# Altium project Accumulator_MGMT_Sys.PrjPcb (part 2 of 2)

## Sheet Latch - AMS.SchDoc
size A4
Used 4 times, as channels Latching - AMS/Latch Circuit, Latching - AMS/Latch Circuit, Latching - AMS/Latch Circuit, Latching - AMS/Latch Circuit. Parts and nets are listed once, with the designators drawn on the sheet.
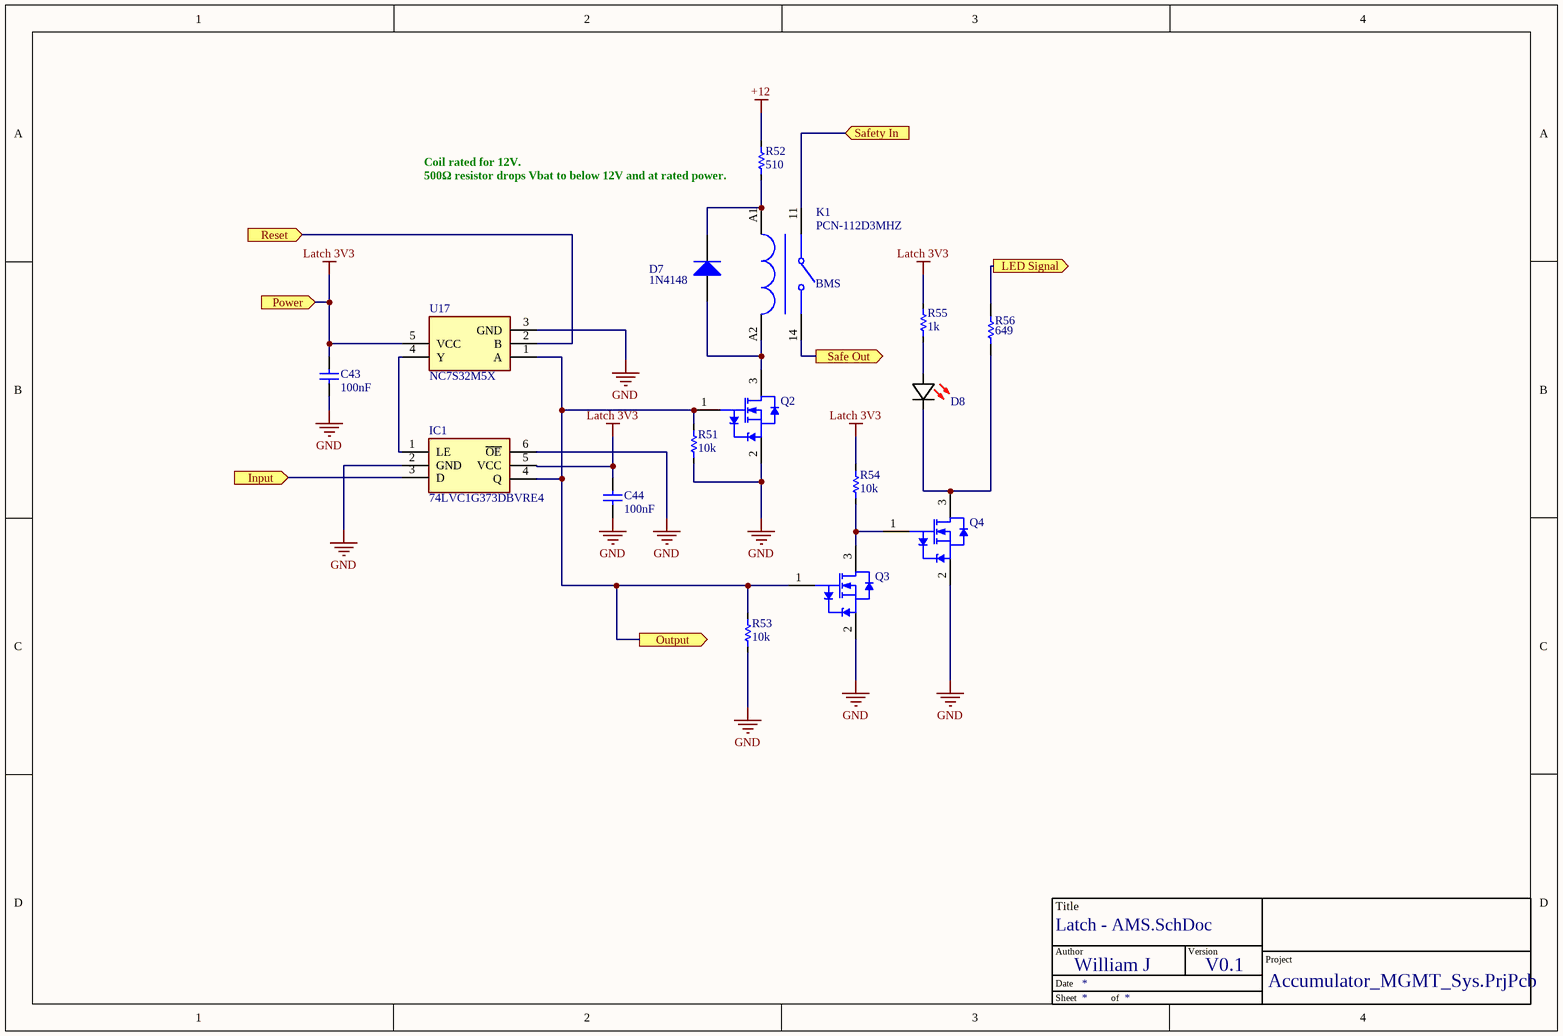
[diagram p7: Latch - AMS.SchDoc]

### Parts
*?  TitleBlock  (value not drawn)  (graphical)
C43  value 100nF  [C_0603]  (hidden comment: C0603C104K3RAC7013)
C44  value 100nF  [C_0603]  (hidden comment: C0603C104K3RAC7013)
D7  1N4148  [425]
D8  150060SS55040  [LED (0603)]  (value not drawn)
IC1  74LVC1G373DBVRE4  [SN74LVC1G373]
K1  PCN-112D3MHZ  [PCN-112D3MHZ]
Q2  BSS138BK,215  [NXP-SOT23_N]  (value not drawn)
Q3  BSS138BK,215  [NXP-SOT23_N]  (value not drawn)
Q4  BSS138BK,215  [NXP-SOT23_N]  (value not drawn)
R51  value 10k  [R-0603]  (hidden comment: RC0603FR-1310KL)
R52  value 510  [R_0805]  (hidden comment: RC0805JR-07510RL)
R53  value 10k  [R-0603]  (hidden comment: RC0603FR-1310KL)
R54  value 10k  [R-0603]  (hidden comment: RC0603FR-1310KL)
R55  value 1k  [R-0603]  (hidden comment: CR0603AFX-1001ELF)
R56  value 649  [RESC6332X06N]  (hidden comment: CRCW2512649RFKEG)
U17  NC7S32M5X  [SOT95P275X110-5N]

### Ports
Input (in), LED Signal (out), Output (out), Power (in), Reset (in), Safe Out (out), Safety In (in)

### Nets
+12: R52.2
GND: C43.1 C44.1 IC1.2(GND) IC1.6(~{OE}) Q2.2(S) Q3.2(S) Q4.2(S) R51.1 R53.1 U17.3(GND)
Latch 3V3: C43.2 C44.2 IC1.5(VCC) R54.2 R55.2 U17.5(VCC) ; port Power
Input: IC1.3(D) ; port Input
LED Signal: R56.2 ; port LED Signal
Output: IC1.4(Q) Q2.1(G) Q3.1(G) R51.2 R53.2 U17.1(A) ; port Output
Reset: U17.2(B) ; port Reset
Safe Out: K1.14 ; port Safe Out
Safety In: K1.11 ; port Safety In
NetD7_1: D7.1(A) K1.A2 Q2.3(D)
NetD7_2: D7.2(K) K1.A1 R52.1
NetD8_1: D8.1(K) Q4.3(D) R56.1
NetD8_2: D8.2(A) R55.1
NetIC1_1: IC1.1(LE) U17.4(Y)
NetQ3_3: Q3.3(D) Q4.1(G) R54.1

### Channels
Latching - AMS/Latch Circuit: designators *?=*?_Latching_-_AMS_Latch_Circuit#1 C43=C43_Latching_-_AMS_Latch_Circuit#1 C44=C44_Latching_-_AMS_Latch_Circuit#1 D7=D7_Latch_Circuit4 D8=D8_Latch_Circuit4 IC1=IC1_Latch_Circuit4 K1=K1_Latch_Circuit4 Q2=Q2_Latch_Circuit4 Q3=Q3_Latch_Circuit4 Q4=Q4_Latch_Circuit4 R51=R51_Latching_-_AMS_Latch_Circuit#1 R52=R52_Latching_-_AMS_Latch_Circuit#1 R53=R53_Latching_-_AMS_Latch_Circuit#1 R54=R54_Latching_-_AMS_Latch_Circuit#1 R55=R55_Latching_-_AMS_Latch_Circuit#1 R56=R56_Latch_Circuit4 U17=U17_Latch_Circuit4; ports Input=NetIC1_Latch_Circuit4_3 LED Signal=IMD.LED Output=MCU.IMD Power=3V3-BMS Reset=Reset Safe Out=NetK1_Latch_Circuit2_11 Safety In=NetK1_Latch_Circuit1_14
Latching - AMS/Latch Circuit: designators *?=*?_Latching_-_AMS_Latch_Circuit#2 C43=C43_Latching_-_AMS_Latch_Circuit#2 C44=C44_Latching_-_AMS_Latch_Circuit#2 D7=D7_Latch_Circuit3 D8=D8_Latch_Circuit3 IC1=IC1_Latch_Circuit3 K1=K1_Latch_Circuit3 Q2=Q2_Latch_Circuit3 Q3=Q3_Latch_Circuit3 Q4=Q4_Latch_Circuit3 R51=R51_Latching_-_AMS_Latch_Circuit#2 R52=R52_Latching_-_AMS_Latch_Circuit#2 R53=R53_Latching_-_AMS_Latch_Circuit#2 R54=R54_Latching_-_AMS_Latch_Circuit#2 R55=R55_Latching_-_AMS_Latch_Circuit#2 R56=R56_Latch_Circuit3 U17=U17_Latch_Circuit3; ports Input=BMS-Ready LED Signal=AMS.LED Output=MCU.AMS Power=3V3-BMS Reset=Reset Safe Out=NetK1_Latch_Circuit1_11 Safety In=Safe-IN
Latching - AMS/Latch Circuit: designators *?=*?_Latching_-_AMS_Latch_Circuit#3 C43=C43_Latching_-_AMS_Latch_Circuit#3 C44=C44_Latching_-_AMS_Latch_Circuit#3 D7=D7_Latch_Circuit2 D8=D8_Latch_Circuit2 IC1=IC1_Latch_Circuit2 K1=K1_Latch_Circuit2 Q2=Q2_Latch_Circuit2 Q3=Q3_Latch_Circuit2 Q4=Q4_Latch_Circuit2 R51=R51_Latching_-_AMS_Latch_Circuit#3 R52=R52_Latching_-_AMS_Latch_Circuit#3 R53=R53_Latching_-_AMS_Latch_Circuit#3 R54=R54_Latching_-_AMS_Latch_Circuit#3 R55=R55_Latching_-_AMS_Latch_Circuit#3 R56=R56_Latch_Circuit2 U17=U17_Latch_Circuit2; ports Input=PDOC-Ready LED Signal=PDOC.LED Output=MCU.PDOC Power=3V3-BMS Reset=Reset Safe Out=Safe-OUT Safety In=NetK1_Latch_Circuit2_11
Latching - AMS/Latch Circuit: designators *?=*?_Latching_-_AMS_Latch_Circuit#4 C43=C43_Latching_-_AMS_Latch_Circuit#4 C44=C44_Latching_-_AMS_Latch_Circuit#4 D7=D7_Latch_Circuit1 D8=D8_Latch_Circuit1 IC1=IC1_Latch_Circuit1 K1=K1_Latch_Circuit1 Q2=Q2_Latch_Circuit1 Q3=Q3_Latch_Circuit1 Q4=Q4_Latch_Circuit1 R51=R51_Latching_-_AMS_Latch_Circuit#4 R52=R52_Latching_-_AMS_Latch_Circuit#4 R53=R53_Latching_-_AMS_Latch_Circuit#4 R54=R54_Latching_-_AMS_Latch_Circuit#4 R55=R55_Latching_-_AMS_Latch_Circuit#4 R56=R56_Latch_Circuit1 U17=U17_Latch_Circuit1; ports Input=BSPD-Ready LED Signal=BSPD.LED Output=MCU.BSPD Power=3V3-BMS Reset=Reset Safe Out=NetK1_Latch_Circuit1_14 Safety In=NetK1_Latch_Circuit1_11

### Notes on the sheet
- (near R52) Coil rated for 12V.
  500Ω resistor drops Vbat to below 12V and at rated power.
- (near K1) BMS
- (in symbol TitleBlock) Title; Author; Version; Project; Date; Sheet; of

### Library data of the parts
C43 C44 = Capacitor: ComponentLink1Description: New link; ComponentLink1URL: *
D7 = 1N4148W-7-F: DIODE GEN PURP 100V 300MA SOD123; Manufacturer 1: Diodes; Forward Current: 150mA; Element Configuration: Single; Reverse Recovery Time: 4ns; Max Forward Surge Current (Ifsm): 2A; Polarity: Standard; Voltage Rating (DC): 75V; Power Rating: 400mW; Capacitance: 2pF; Peak Reverse Current: 1uA; Forward Voltage: 1.25V; Supplier 1: Digi-Key; Supplier Part Number 1: 1N4148W-FDIDKR-ND; Manufacturer Part Number 1: 1N4148W-7-F; Stock 1: 3523690; Pricing 1: 1=0.16000, 10=0.14600, 25=0.13880, 100=0.06110, 250=0.05868, 500=0.04800, 1000=0.03333 (USD); RoHS: Yes; Mount: Surface Mount; Number of Pins: 2; Weight: 0.000353oz; Contact Plating: Tin,Matte; Min Operating Temperature: -65°C; Max Operating Temperature: 150°C; Voltage: 100V; Packaging: Tape and Reel; Max Repetitive Reverse Voltage (Vrrm): 100V; Peak Non-Repetitive Surge Current: 2A; Current Rating: 150mA; Output Current: 150mA; Max Surge Current: 2A; Package Quantity: 3000; Recovery Time: 4ns; Max Reverse Voltage (DC): 100V; Average Rectified Current: 300mA; Power Dissipation: 400mW; Length: 2.85mm; Height: 1.25mm; Width: 1.7mm; Radiation Hardening: No; REACH SVHC: No SVHC; Lead Free: Lead Free; ComponentLink1URL: https://datasheet.ciiva.com/911/ds30086-911734.pdf?src-supplier=Digi-Key; ComponentLink1Description: https://datasheet.ciiva.com/911/ds30086-911734.pdf?src-supplier=Digi-Key; ComponentLink2URL: https://datasheet.ciiva.com/911/ds30086-911735.pdf?src-supplier=Digi-Key; ComponentLink2Description: https://datasheet.ciiva.com/911/ds30086-911735.pdf?src-supplier=Digi-Key; ComponentLink3URL: https://datasheet.ciiva.com/911/ds30086-911736.pdf?src-supplier=Digi-Key; ComponentLink3Description: https://datasheet.ciiva.com/911/ds30086-911736.pdf?src-supplier=Digi-Key; ComponentLink4URL: https://datasheet.ciiva.com/8300/ds30086-8300392.pdf?src-supplier=Avnet; ComponentLink4Description: https://datasheet.ciiva.com/8300/ds30086-8300392.pdf?src-supplier=Avnet; ComponentLink5URL: https://datasheet.ciiva.com/25919/ds30086-25919609.pdf?src-supplier=Avnet+Europe; ComponentLink5Description: https://datasheet.ciiva.com/25919/ds30086-25919609.pdf?src-supplier=Avnet+Europe; ComponentLink6URL: https://datasheet.ciiva.com/22695/1915529-22695239.pdf?src-supplier=Element14; ComponentLink6Description: https://datasheet.ciiva.com/22695/1915529-22695239.pdf?src-supplier=Element14; ComponentLink7URL: https://datasheet.ciiva.com/1179/1915529-1179304.pdf?src-supplier=Element14; ComponentLink7Description: https://datasheet.ciiva.com/1179/1915529-1179304.pdf?src-supplier=Element14; ComponentLink8URL: https://datasheet.ciiva.com/4435/ds30086-4435128.pdf?src-supplier=Mouser; ComponentLink8Description: https://datasheet.ciiva.com/4435/ds30086-4435128.pdf?src-supplier=Mouser; ComponentLink9URL: https://datasheet.ciiva.com/15219/getdatasheetpartid-110030-15219548.pdf?src-supplier=Verical; ComponentLink9Description: https://datasheet.ciiva.com/15219/getdatasheetpartid-110030-15219548.pdf?src-supplier=Verical; ComponentLink10URL: https://datasheet.ciiva.com/8303/ds30086-8303197.pdf?src-supplier=Avnet; ComponentLink10Description: https://datasheet.ciiva.com/8303/ds30086-8303197.pdf?src-supplier=Avnet
D8 = 150060SS55040: LED RED DIFFUSED 0603 SMD; Manufacturer: Wurth Electronics; Lens Style: Flat; Luminous Intensity: 70mcd; Forward Voltage: 2V; Test Current: 20mA; Viewing Angle: 140°; Dominant Wavelength: 630nm; Lens Size: 0.8mm; Supplier 1: Mouser; Manufacturer Part Number: 150060SS55040; RoHS: No; Category: LEDs; Stock 1: 17006; Pricing 1: 1=0.18000, 10=0.16800, 50=0.16800, 100=0.15200, 1000=0.12100, 10000=0.10600 (USD); Mount: Surface Mount; Case/Package: 0603; Color: Red; Case Code (Imperial): 0603; Case Code (Metric): 1608; Packaging: Tape and Reel; Lens Transparency: Diffused; Length: 1.6mm; Width: 0.8mm; Height: 0.5mm; RoHS Compliant: No; Supplier Part Number 1: 710-150060SS55040
IC1 = 74LVC1G373DBVRE4: Integrated Circuit; Manufacturer_Name: Texas Instruments; Datasheet Link: http://www.ti.com/general/docs/suppproductinfo.tsp?distId=10&gotoUrl=http%3A%2F%2Fwww.ti.com%2Flit%2Fgpn%2Fsn74lvc1g373; Height: 1.45mm; Manufacturer_Part_Number: 74LVC1G373DBVRE4
K1 = PCN-112D3MHZ: Relay
Q2-Q4 = CMP-1259-00087-1: N-Channel Trench MOSFET, 60 V, 0.36 A, -55 to 150 degC, 3-Pin SOT23, Tape and Reel; Manufacturer: NXP Semiconductors; Channel Type: N; IDM [max] (A): 1.2; VDS [max] (V): 60; Packing: Tape & Reel; ID [max] (A): 0.36; Automotive Qualified: Y; VGSth [typ] (V): 1.1; PackageReference: SOT23; Code_JEDEC: TO-236AB; PackageDescription: 3-Pin Small Outline Transistor Package, Body 2.9 x 1.3 mm, Pitch 0.95 mm; ComponentLink2URL: http://www.nxp.com/documents/data_sheet/BSS138BK.pdf; PartNumber: BSS138BK,215; DatasheetVersion: Rev. 1; ComponentLink3Description: Package Specification; ComponentLink3URL: http://www.nxp.com/documents/outline_drawing/sot023_po.pdf; Mounting Technology: Surface Mount; ComponentLink1URL: http://www.nxp.com/; ComponentLink1Description: Manufacturer URL; ComponentLink2Description: Datasheet; PackageVersion: 06-03-16, 03/2006
R51-R55 = Resistor
R56 = CRCW2512649RFKEG: RES SMD 649 OHM 1% 1W 2512; Manufacturer 1: Vishay Dale; Temperature Coefficient: 100ppm/°C; Voltage Rating (DC): 500V; Supplier 1: Digi-Key; Supplier Part Number 1: 541-649AFCT-ND; Manufacturer Part Number 1: CRCW2512649RFKEG; Stock 1: 2166; Pricing 1: 1=0.38000, 10=0.31800, 100=0.12420, 1000=0.05198 (USD); RoHS: Yes; Case/Package: 2512; Case Code (Metric): 6432; Case Code (Imperial): 2512; Min Operating Temperature: -55°C; Max Operating Temperature: 155°C; Package Quantity: 10; Tolerance: 1%; Packaging: Tape and Reel; Composition: Thick Film; Number of Terminations: 2; Features: Automotive AEC-Q200; Max Power Dissipation: 1W; Length: 0.248inch; Height: 0.028inch; Width: 0.124inch; Lead Free: Lead Free
U17 = NC7S32M5X: OR GATEEEE; Manufacturer_Name: ON Semiconductor; Datasheet Link: https://componentsearchengine.com/Datasheets/2/NC7S32M5X.pdf; Height: 1.1mm; Manufacturer_Part_Number: NC7S32M5X

## Sheet PDOC - AMS.SchDoc
size Letter
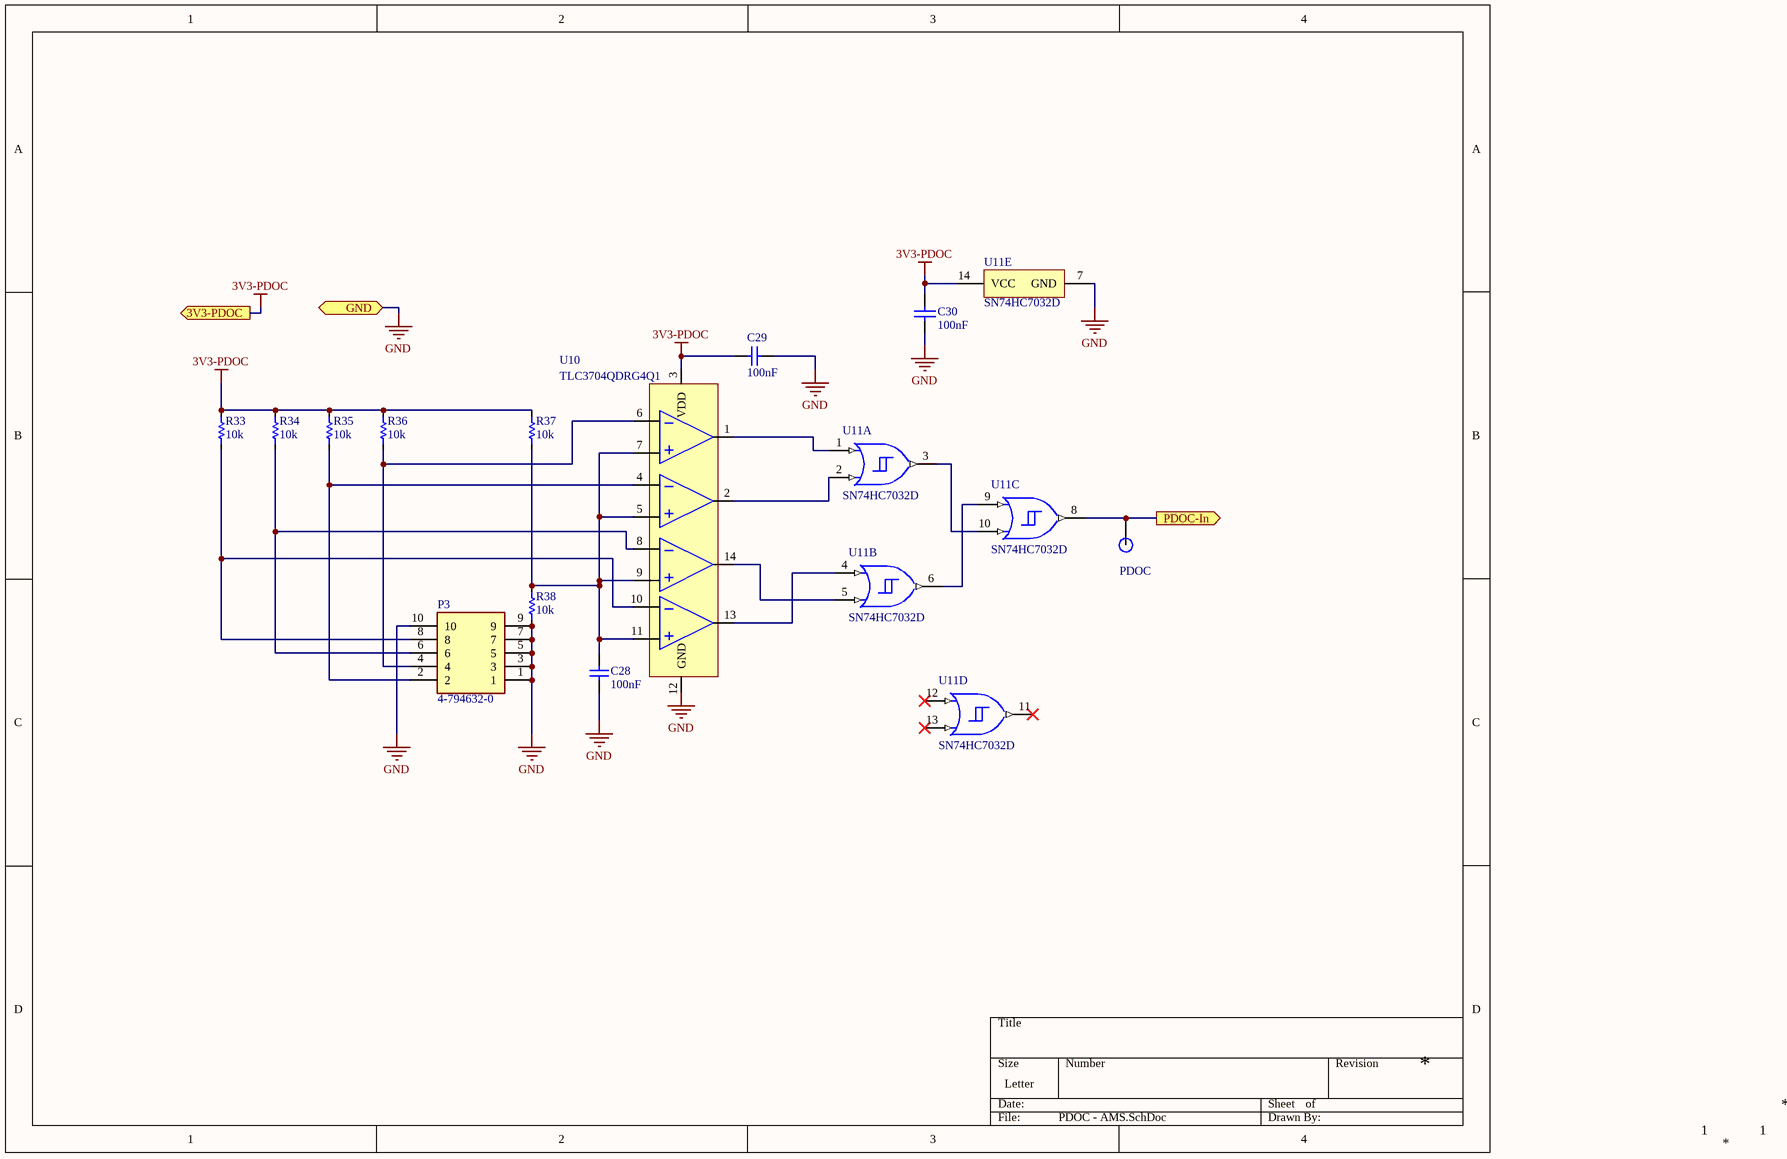
[diagram p8: PDOC - AMS.SchDoc]

### Parts
C28  value 100nF  [C_0603]  (hidden comment: C0603C104K3RAC7013)
C29  value 100nF  [C_0603]  (hidden comment: C0603C104K3RAC7013)
C30  value 100nF  [CAP0603]  (hidden comment: C0603C104K3RAC7013)
P3  4-794632-0  [SHDR10W82P300_2X5_1586X686X944P]
PDOC  1.2mm Test point  [Test Point]  (value not drawn)  (no BOM)
R33  value 10k  [R-0603]  (hidden comment: RC0603FR-1310KL)
R34  value 10k  [R-0603]  (hidden comment: RC0603FR-1310KL)
R35  value 10k  [R-0603]  (hidden comment: RC0603FR-1310KL)
R36  value 10k  [R-0603]  (hidden comment: RC0603FR-1310KL)
R37  value 10k  [R-0603]  (hidden comment: RC0603FR-1310KL)
R38  value 10k  [R-0603]  (hidden comment: RC0603FR-1310KL)
U10  TLC3704QDRG4Q1  [SOIC127P600X175-14N]
U11  SN74HC7032D  [D0014A_L]  (parts A,B,C,D,E of 5)

### Ports
3V3-PDOC (out), GND (bidir), PDOC-In (out)

### Nets
3V3-PDOC: C29.2 C30.2 R33.2 R34.2 R35.2 R36.2 R37.2 U10.3(VDD) U11.14(VCC) ; port 3V3-PDOC  [project net 3V3-BMS]
GND: C28.1 C29.1 C30.1 P3.1 P3.3 P3.5 P3.7 P3.9 P3.10 R38.1 U10.12(GND) U11.7(GND) ; port GND
PDOC-In: PDOC.1 U11.8(3Y) ; port PDOC-In
NetC28_2: C28.2 R37.1 R38.2 U10.5(In2+) U10.7(In1+) U10.9(In3+) U10.11(In4+)
NetP3_2: P3.2 R35.1 U10.4(In2-)
NetP3_4: P3.4 R36.1 U10.6(In1-)
NetP3_6: P3.6 R34.1 U10.8(In3-)
NetP3_8: P3.8 R33.1 U10.10(In4-)
NetU10_1: U10.1(Out1) U11.1(1A)
NetU10_2: U10.2(Out2) U11.2(1B)
NetU10_13: U10.13(Out4) U11.4(2A)
NetU10_14: U10.14(Out3) U11.5(2B)
NetU11_3: U11.3(1Y) U11.10(3B)
NetU11_6: U11.6(2Y) U11.9(3A)

Not connected (* = marked no-connect by the designer): U11 11(4Y)* 12(4A)* 13(4B)*

### Notes on the sheet
- 1

### Library data of the parts
C28 C29 = Capacitor: ComponentLink1Description: New link; ComponentLink1URL: *
C30 = Cap: Published: 8-Jun-2000; LatestRevisionDate: 17-Jul-2002; LatestRevisionNote: Re-released for DXP Platform.; PackageReference: RAD-0.3; Publisher: Altium Limited; PackageDescription: Radial Cap, Thru-Hole; 2 Leads; 0.3 in Pin Spacing
P3 = 4-794632-0: Connector; Manufacturer_Name: TE Connectivity; Datasheet Link: https://www.mouser.com/ProductDetail/TE-Connectivity-AMP/4-794632-0?qs=Rd%252BN518myCyGOpGRvqIhCg%3D%3D; Height: 9.44mm; Manufacturer_Part_Number: 4-794632-0; Mouser Part Number: 571-4-794632-0; Mouser Price/Stock: https://www.mouser.co.uk/ProductDetail/TE-Connectivity-AMP/4-794632-0?qs=Rd%252BN518myCyGOpGRvqIhCg%3D%3D
PDOC = Test Point
R33-R38 = Resistor
U10 = TLC3704QDRG4Q1: IC VOLT COMPARATOR QUAD 14-SOIC; Manufacturer 1: Texas Instruments; Common Mode Rejection Ratio: 84dB; Min Supply Voltage: 3V; Max Supply Voltage: 16V; Operating Supply Voltage: 5V; Nominal Supply Current: 80uA; Max Power Dissipation: 950mW; Number of Elements: 4; Input Offset Voltage (Vos): 5mV; Input Bias Current: 5pA; Output Current: 20mA; Quiescent Current: 175uA; Propagation Delay: 4.5us; Response Time: 0.3us; Power Supply Rejection Ratio (PSRR): 85dB; Output Type: TTL; Supplier 1: Digi-Key; Supplier Part Number 1: 296-23711-1-ND; Manufacturer Part Number 1: TLC3704QDRG4Q1; Stock 1: 3794; Pricing 1: 1=1.68000, 10=1.50700, 100=1.21100, 500=0.99498, 1000=0.82441 (USD); RoHS: Yes; Mount: Surface Mount; Case/Package: SOIC; Number of Pins: 14; Weight: 0.004318oz; Contact Plating: Gold; Min Operating Temperature: -40°C; Max Operating Temperature: 125°C; Packaging: Tape and Reel; Package Quantity: 2500; Max Supply Current: 80uA; Number of Bits: 4; Number of Channels: 4; Max Input Current: 5pA; Power Dissipation: 950mW; Type: General Purpose; Radiation Hardening: No; Lead Free: Lead Free; ComponentLink1URL: https://datasheet.ciiva.com/1828/tlc3704-q1-1828544.pdf?src-supplier=Digi-Key; ComponentLink1Description: https://datasheet.ciiva.com/1828/tlc3704-q1-1828544.pdf?src-supplier=Digi-Key; ComponentLink2URL: https://datasheet.ciiva.com/4464/sgls191a-104586-4464808.pdf?src-supplier=Mouser; ComponentLink2Description: https://datasheet.ciiva.com/4464/sgls191a-104586-4464808.pdf?src-supplier=Mouser; ComponentLink3URL: https://datasheet.ciiva.com/15131/getdatasheetpartid-331461-15131244.pdf?src-supplier=Verical; ComponentLink3Description: https://datasheet.ciiva.com/15131/getdatasheetpartid-331461-15131244.pdf?src-supplier=Verical; ComponentLink4URL: https://datasheet.ciiva.com/14391/tlc3704-q1-14391948.pdf?src-supplier=Avnet; ComponentLink4Description: https://datasheet.ciiva.com/14391/tlc3704-q1-14391948.pdf?src-supplier=Avnet; ComponentLink5URL: https://datasheet.ciiva.com/1828/tlc3704-q1-1828542.pdf?src-supplier=Digi-Key; ComponentLink5Description: https://datasheet.ciiva.com/1828/tlc3704-q1-1828542.pdf?src-supplier=Digi-Key; ComponentLink6URL: https://datasheet.ciiva.com/1828/tlc3704-q1-1828543.pdf?src-supplier=Digi-Key; ComponentLink6Description: https://datasheet.ciiva.com/1828/tlc3704-q1-1828543.pdf?src-supplier=Digi-Key
U11 = CMP-0781-00002-4: Quadruple Positive-OR Gates With Schmitt-Trigger Inputs, D0014A, TUBE; Manufacturer: Texas Instruments; Output Drive (IOL/IOH)(Max)(mA): 5.2/-5.2; Output Type: CMOS; Bits(#): 4; Rating: Catalog; VCC(Max)(V): 6; VCC(Min)(V): 2; ICC @ Nom Voltage(Max)(mA): 0.02; Voltage(Nom)(V): 5; tpd @ Nom Voltage(Max)(ns): 33; F @ Nom Voltage(Max)(Mhz): 70; Code_JEDEC: MS-012; Generic Part Number: SN74HC7032; PackageReference: D0014A; DatasheetVersion: SCLS036E; PackageVersion: http://www.ti.com/lit/ml/mpds177g/mpds177g.pdf; Operating Temperature Range(C): -40 to 85; Input Type: CMOS

## Sheet Independent Power Supply - AMS.SchDoc
size A4
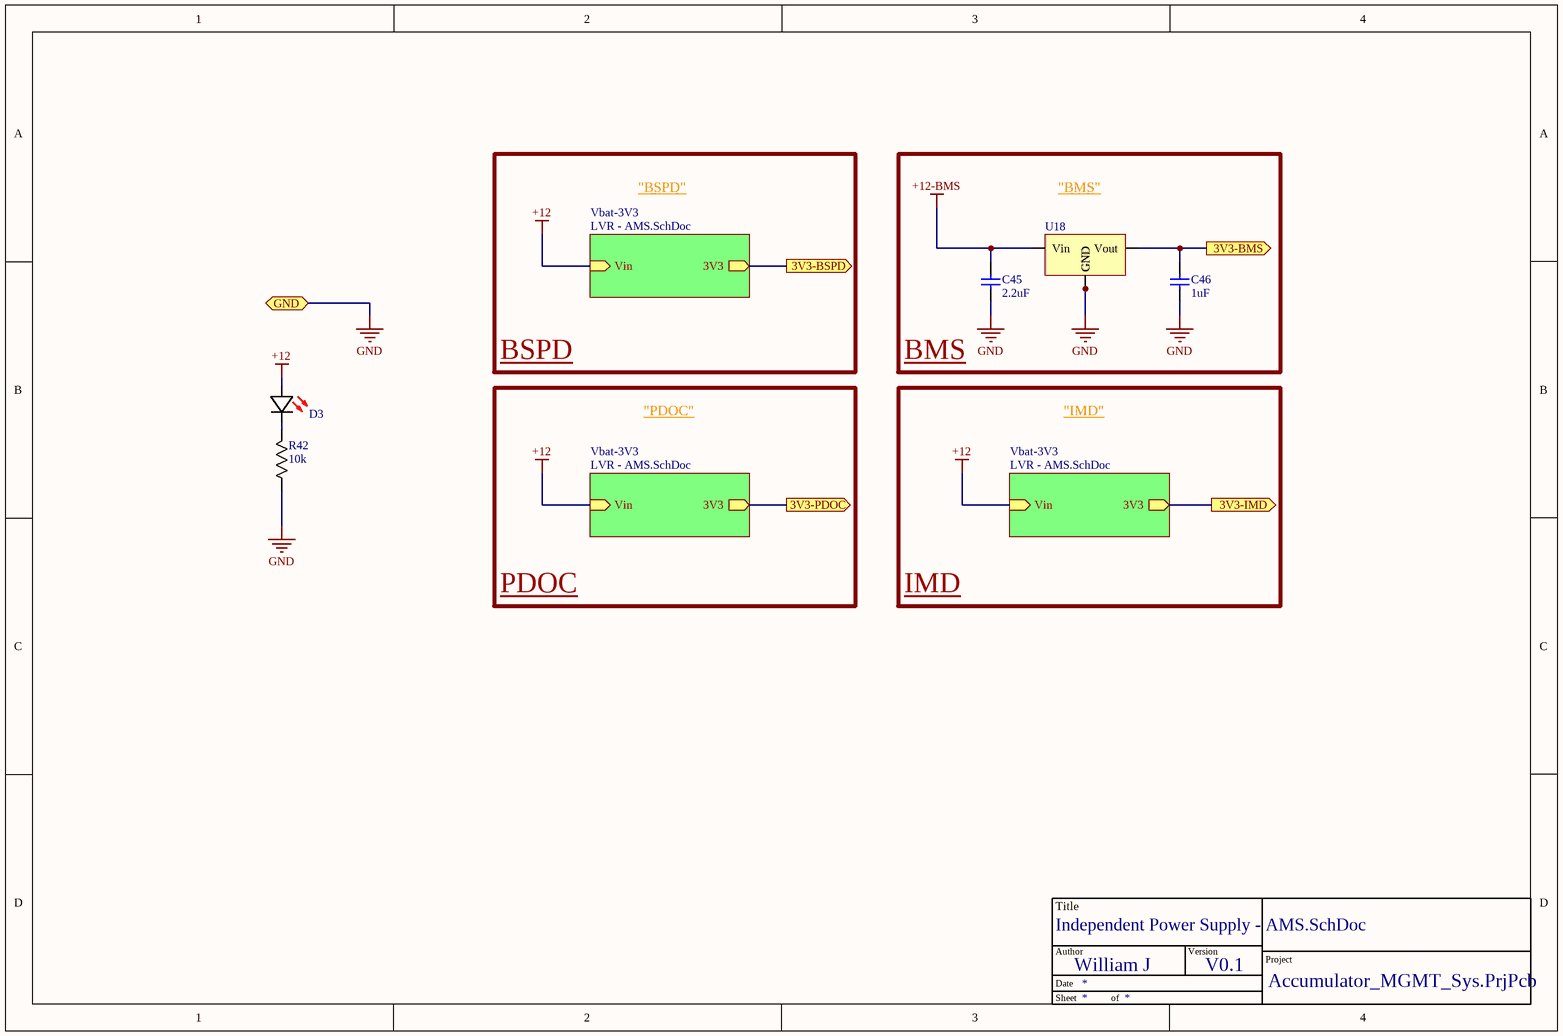
[diagram p9: Independent Power Supply - AMS.SchDoc]

### Parts
(Parts that share a designator on the sheet are numbered #1, #2 ... from top to bottom, then left to right.)
*#7  TitleBlock  (value not drawn)  (graphical)
C45  value 2.2uF  [C_0603]  (hidden comment: CL10A225KP8NNNC)
C46  value 1uF  [C_0603]  (hidden comment: CL10A105KP8NNNL)
D3  150060SS55040  [LED (0603)]  (value not drawn)
R42  value 10k  [R-0603]  (hidden comment: RC0603FR-1310KL)
U18  BD33C0AHFP-CTR  [HRP5]  (value not drawn)

### Blocks framed on the sheet
BMS: C45 C46 U18

### Sub-sheets
Vbat-3V3 = LVR - AMS.SchDoc: Vin (in), 3V3 (out)
Vbat-3V3 = LVR - AMS.SchDoc: Vin (in), 3V3 (out)
Vbat-3V3 = LVR - AMS.SchDoc: Vin (in), 3V3 (out)

### Ports
3V3-BMS (out), 3V3-BSPD (out), 3V3-IMD (out), 3V3-PDOC (out), GND (bidir)

### Nets
3V3-BMS: C46.2 U18.5(Vout) ; port 3V3-PDOC, port 3V3-BSPD, port 3V3-BMS, port 3V3-IMD, sheet Vbat-3V3/3V3, sheet Vbat-3V3/3V3, sheet Vbat-3V3/3V3
+12: D3.2(A) ; sheet Vbat-3V3/Vin, sheet Vbat-3V3/Vin, sheet Vbat-3V3/Vin
+12-BMS: C45.2 U18.1(Vin)
GND: C45.1 C46.1 R42.1 U18.3(GND) U18.6(GND) ; port GND
NetD3_1: D3.1(K) R42.2

### Notes on the sheet
- "BSPD"
- (near U18) "BMS"
- BSPD
- "PDOC"
- "IMD"
- PDOC
- IMD
- (in symbol TitleBlock) Title; Author; Version; Project; Date; Sheet; of

### Library data of the parts
C45 C46 = Capacitor: ComponentLink1Description: New link; ComponentLink1URL: *
D3 = 150060SS55040: as D8 on sheet Latch - AMS; Supplier 1: Mouser; Manufacturer Part Number: 150060SS55040; RoHS: No; Category: LEDs; Stock 1: 17006; Pricing 1: 1=0.18000, 10=0.16800, 50=0.16800, 100=0.15200, 1000=0.12100, 10000=0.10600 (USD); Mount: Surface Mount; Case/Package: 0603; Color: Red; Case Code (Imperial): 0603; Case Code (Metric): 1608; Packaging: Tape and Reel; Lens Transparency: Diffused; Length: 1.6mm; Width: 0.8mm; Height: 0.5mm; RoHS Compliant: No; Supplier Part Number 1: 710-150060SS55040
R42 = Resistor
U18 = BD33C0AHFP-CTR: LDO Voltage Regulators 35V RESIS 1A LDO REGULATOR

## Sheet LVR - AMS.SchDoc
size A4
Used 3 times, as channels Linear Voltage Regulators/Vbat-3V3, Linear Voltage Regulators/Vbat-3V3, Linear Voltage Regulators/Vbat-3V3. Parts and nets are listed once, with the designators drawn on the sheet.
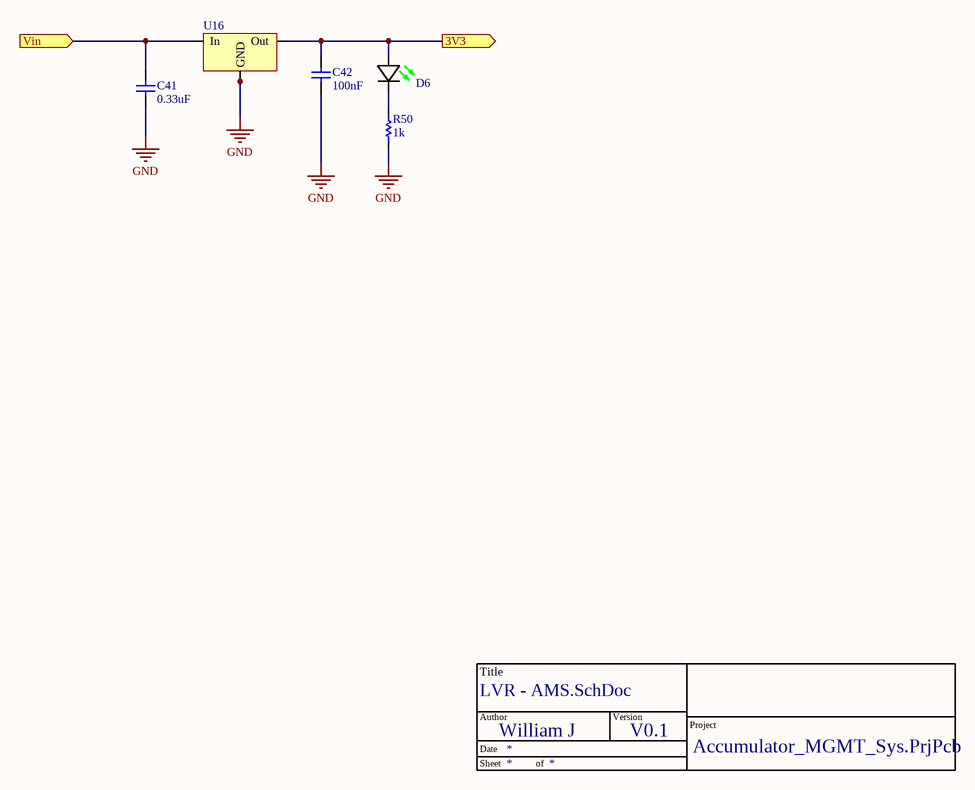
[diagram p10: LVR - AMS.SchDoc]

### Parts
*?  TitleBlock  (value not drawn)  (graphical)
C41  value 0.33uF  [C_0603]  (hidden comment: 885012206074)
C42  value 100nF  [C_0603]  (hidden comment: C0603C104K3RAC7013)
D6  150060GS55040  [LED (0603)]  (value not drawn)
R50  value 1k  [R-0603]  (hidden comment: CR0603AFX-1001ELF)
U16  ZSR330GTA  [ZSR330GTA]  (value not drawn)

### Ports
3V3 (out), Vin (in)

### Nets
GND: C41.1 C42.1 R50.1 U16.2(GND) U16.4(GND)
3V3: C42.2 D6.2(A) U16.1(Out) ; port 3V3
Vin: C41.2 U16.3(In) ; port Vin
NetD6_1: D6.1(K) R50.2

### Channels
Linear Voltage Regulators/Vbat-3V3: designators *?=*?_Linear_Voltage_Regulators_Vbat-3V3#1 C41=C41_Linear_Voltage_Regulators_Vbat-3V3#1 C42=C42_Linear_Voltage_Regulators_Vbat-3V3#1 D6=D6_Vbat-3V34 R50=R50_Linear_Voltage_Regulators_Vbat-3V3#1 U16=U16_Vbat-3V34; ports 3V3=3V3-BMS Vin=+12
Linear Voltage Regulators/Vbat-3V3: designators *?=*?_Linear_Voltage_Regulators_Vbat-3V3#2 C41=C41_Linear_Voltage_Regulators_Vbat-3V3#2 C42=C42_Linear_Voltage_Regulators_Vbat-3V3#2 D6=D6_Vbat-3V33 R50=R50_Linear_Voltage_Regulators_Vbat-3V3#2 U16=U16_Vbat-3V33; ports 3V3=3V3-BMS Vin=+12
Linear Voltage Regulators/Vbat-3V3: designators *?=*?_Linear_Voltage_Regulators_Vbat-3V3#3 C41=C41_Linear_Voltage_Regulators_Vbat-3V3#3 C42=C42_Linear_Voltage_Regulators_Vbat-3V3#3 D6=D6_Vbat-3V32 R50=R50_Linear_Voltage_Regulators_Vbat-3V3#3 U16=U16_Vbat-3V32; ports 3V3=3V3-BMS Vin=+12

### Notes on the sheet
- (in symbol TitleBlock) Title; Author; Version; Project; Date; Sheet; of

### Library data of the parts
C41 C42 = Capacitor: ComponentLink1Description: New link; ComponentLink1URL: *
D6 = 150060GS55040: LED GREEN DIFFUSED 0603 SMD; Manufacturer: Wurth Electronics; Lens Style: Flat; Luminous Intensity: 430mcd; Forward Voltage: 3.2V; Test Current: 20mA; Viewing Angle: 140°; Dominant Wavelength: 525nm; Lens Size: 0.8mm; Supplier 1: Mouser; Manufacturer Part Number: 150060GS55040; RoHS: No; Category: LEDs; Stock 1: 3998; Pricing 1: 1=0.23000, 10=0.21000, 50=0.21000, 100=0.19000, 1000=0.15200, 10000=0.13200 (USD); Mount: Surface Mount; Case/Package: 0603; Color: Green; Case Code (Imperial): 0603; Case Code (Metric): 1608; Packaging: Cut Tape; Lens Transparency: Diffused; Length: 1.6mm; Width: 0.8mm; Height: 0.5mm; RoHS Compliant: No; ComponentLink1URL: http://www.farnell.com/datasheets/2621642.pdf?src-supplier=Farnell; ComponentLink1Description: http://www.farnell.com/datasheets/2621642.pdf?src-supplier=Farnell; ComponentLink2URL: http://katalog.we-online.de/pbs/datasheet/150060GS55040.pdf?src-supplier=Digi-Key; ComponentLink2Description: http://katalog.we-online.de/pbs/datasheet/150060GS55040.pdf?src-supplier=Digi-Key; ComponentLink3URL: https://www.we-online.de/web/en/index.php/download/media/07_electronic_components/download_center_1/application_notes_berichte/ano002_leds___the_future_of_horticultural_lighting/ANO002b_EN_LEDs_The_Future_of_Horticultural_Lighting.pdf?src-supplier=Digi-Key; ComponentLink3Description: https://www.we-online.de/web/en/index.php/download/media/07_electronic_components/download_center_1/application_notes_berichte/ano002_leds___the_future_of_horticultural_lighting/ANO002b_EN_LEDs_The_Future_of_Horticultural_Lighting.pdf?src-supplier=Digi-Key; ComponentLink4URL: https://katalog.we-online.de/pbs/datasheet/150060GS55040.pdf?src-supplier=Digi-Key; ComponentLink4Description: https://katalog.we-online.de/pbs/datasheet/150060GS55040.pdf?src-supplier=Digi-Key; ComponentLink5URL: http://www.farnell.com/datasheets/2621642.pdf?src-supplier=Newark; ComponentLink5Description: http://www.farnell.com/datasheets/2621642.pdf?src-supplier=Newark; Supplier Part Number 1: 710-150060GS55040
R50 = Resistor
U16 = ZSR330GTA: Standard Regulator Pos 3.3V 0.2A 4-Pin(3+Tab) SOT-223 T/R; Manufacturer: Diodes Zetex; Output Type: Fixed; Max Output Current: 200mA; Number of Outputs: 1; Max Input Voltage: 20V; Min Input Voltage: 5.3V; Max Power Dissipation: 2W; Polarity: Positive; Quiescent Current: 600uA; Accuracy: 2.5%; Power Supply Rejection Ratio (PSRR): 64dB; Supplier 1: RSComponents; Manufacturer Part Number: ZSR330GTA; RoHS: No; Category: Voltage Regulators - Linear; Stock 1: 90; Pricing 1: 5=1.13900, 25=0.99200, 50=0.94200, 250=0.74500, 500=0.66700, 5=0.82000, 25=0.71400, 50=0.67800, 250=0.53600, 500=0.48000 (USD); Mount: Surface Mount; Case/Package: SOT-223; Weight: 0.000282oz; Min Operating Temperature: -55°C; Max Operating Temperature: 125°C; Output Voltage: 3.3V; Output Voltage Accuracy: 2.5%; Tolerance: 2.5%; Power Rating: 2W; Packaging: Tape and Reel; Output Current: 200mA; Package Quantity: 1000; Number of Regulators: 1; Reference Voltage: 3.3V; Power Dissipation: 2W; Length: 6.7mm; Width: 3.7mm; Height: 1.65mm; Radiation Hardening: No; REACH SVHC: No SVHC; Lead Free: Lead Free; ComponentLink1URL: https://datasheet.ciiva.com/4882/zsr-91730-4882775.pdf?src-supplier=Mouser; ComponentLink1Description: https://datasheet.ciiva.com/4882/zsr-91730-4882775.pdf?src-supplier=Mouser; ComponentLink2URL: https://datasheet.ciiva.com/8240/zsr-8240251.pdf?src-supplier=Avnet; ComponentLink2Description: https://datasheet.ciiva.com/8240/zsr-8240251.pdf?src-supplier=Avnet

## Sheet Connectors - AMS.SchDoc
size A4
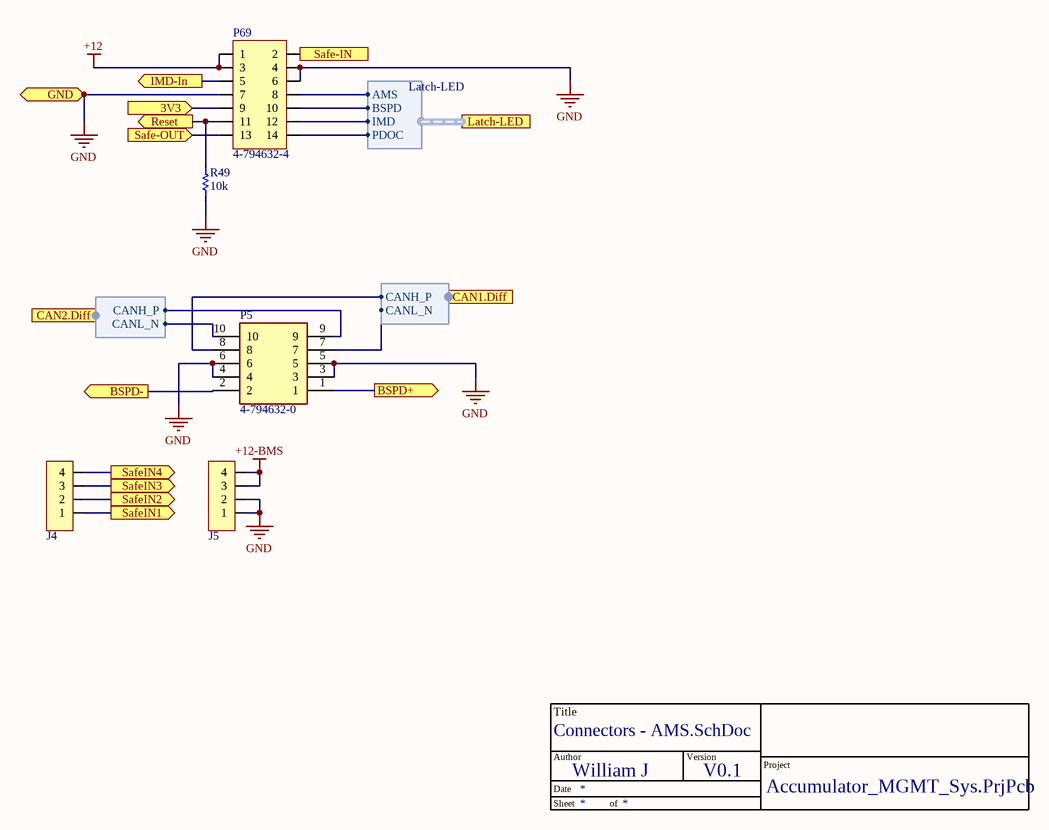
[diagram p11: Connectors - AMS.SchDoc]

### Parts
*?  TitleBlock  (value not drawn)  (graphical)
J4  3-794632-4  [3-794632-4]  (value not drawn)
J5  3-794632-4  [3-794632-4]  (value not drawn)
P5  4-794632-0  [SHDR10W82P300_2X5_1586X686X944P]
P69  4-794632-4  [4-794632-4]
R49  value 10k  [R-0603]  (hidden comment: RC0603FR-1310KL)

### Ports
3V3 (in), BSPD+ (out), BSPD- (out), CAN1.Diff (harness CANDiff), CAN2.Diff (harness CANDiff), GND (bidir), IMD-In (out), Latch-LED (harness Latch-LED), Reset (out), Safe-IN (out), Safe-OUT (in), SafeIN1 (out), SafeIN2 (out), SafeIN3 (out), SafeIN4 (out)

### Harnesses
CANDiff: CANH_P, CANL_N
Latch-LED: AMS, BSPD, IMD, PDOC

### Nets
3V3-BMS: P69.9 ; port 3V3
+12: P69.1 P69.3
+12-BMS: J5.3 J5.4
GND: J5.1 J5.2 P5.3 P5.4 P5.5 P5.6 P69.4 P69.6 P69.7 R49.2 ; port GND
AMS.LED: P69.8 ; port Latch-LED.AMS
BSPD.LED: P69.10 ; port Latch-LED.BSPD
BSPD_N: P5.2 ; port BSPD-
BSPD_P: P5.1 ; port BSPD+
CAN1.Diff_N: P5.7 ; port CAN1.Diff.CANL_N
CAN1.Diff_P: P5.8 ; port CAN1.Diff.CANH_P
CAN2.Diff_N: P5.10 ; port CAN2.Diff.CANL_N
CAN2.Diff_P: P5.9 ; port CAN2.Diff.CANH_P
IMD-In: P69.5 ; port IMD-In
IMD.LED: P69.12 ; port Latch-LED.IMD
PDOC.LED: P69.14 ; port Latch-LED.PDOC
Reset: P69.11 R49.1 ; port Reset
Safe-IN: P69.2 ; port Safe-IN
Safe-OUT: P69.13 ; port Safe-OUT
SafeIN1: J4.1 ; port SafeIN1
SafeIN2: J4.2 ; port SafeIN2
SafeIN3: J4.3 ; port SafeIN3
SafeIN4: J4.4 ; port SafeIN4

### Notes on the sheet
- (in symbol TitleBlock) Title; Author; Version; Project; Date; Sheet; of

### Library data of the parts
J4 J5 = 3-794632-4: Conn Power HDR 4 POS 3mm Solder ST Thru-Hole 4 Terminal 1 Port Box/Tray; Manufacturer: TE Connectivity; Number of Terminals/Pins: 4; Max Voltage Rating (AC): 250V; Connector Type: Pin; Mating Retention: Yes (With); PCB Mount Alignment: No (Without); Current Rating: 5A; Number of Ports: 1; Connector System: Wire-to-Board; PCB Mount Retention: With; PCB Mounting Orientation: Vertical; VDE Tested: Yes; Pitch: 0.118inch; Row Spacing: 0.118mm; PCB Thickness: 1.57mm; Plating Thickness: 2.54um; Approvals: CSA; Supplier 1: Mouser; Manufacturer Part Number: 3-794632-4; RoHS: Yes; Category: Power Connectors; Stock 1: 833; Pricing 1: 1=1.68000, 10=1.43000, 50=1.43000, 100=1.24000, 377=1.09000, 1000=1.09000, 1131=0.93600, 2639=0.87300, 5278=0.83000, 10000=0.83000, 10179=0.81100, 25259=0.79100 (USD); Mount: Through Hole; Housing Color: Black; Contact Material: Brass; Color: Black; Housing Material: Nylon; Contact Plating: Gold,Tin; Min Operating Temperature: -40°C; Max Operating Temperature: 221°C; Packaging: Tray; Package Quantity: 377; Number of Rows: 2; Fastening Type: Ramp; Orientation: Straight; Number of Positions: 4; Termination: Solder; Number of Contacts: 4; Voltage Rating: 250V; Contact Gender: Male; Mating Alignment: Yes (With); Contact Current Rating: 5A; Contact Retention: No (Without); Sealable: No (Without); Circuit Application: Power; Number of Power Positions: 4; Length: 10mm; Width: 9.24mm; Height: 8.67mm; Depth: 8.67mm; Radiation Hardening: No; Flammability Rating: UL94 V-0; Lead Free: Lead Free; ELV: Compliant; ComponentLink1URL: https://datasheet.ciiva.com/717/eng-cd-794632-e-717814.pdf?src-supplier=Digi-Key; ComponentLink1Description: https://datasheet.ciiva.com/717/eng-cd-794632-e-717814.pdf?src-supplier=Digi-Key; ComponentLink2URL: https://datasheet.ciiva.com/30185/eng-cs-82181-softshell-high-density-0508-30185662.pdf?src-supplier=Onlinecomponents.com; ComponentLink2Description: https://datasheet.ciiva.com/30185/eng-cs-82181-softshell-high-density-0508-30185662.pdf?src-supplier=Onlinecomponents.com; Supplier Part Number 1: 571-3-794632-4
P5 = 4-794632-0: as P3 on sheet PDOC - AMS; Datasheet Link: https://www.mouser.com/ProductDetail/TE-Connectivity-AMP/4-794632-0?qs=Rd%252BN518myCyGOpGRvqIhCg%3D%3D; Height: 9.44mm; Manufacturer_Part_Number: 4-794632-0; Mouser Part Number: 571-4-794632-0; Mouser Price/Stock: https://www.mouser.co.uk/ProductDetail/TE-Connectivity-AMP/4-794632-0?qs=Rd%252BN518myCyGOpGRvqIhCg%3D%3D
P69 = 4-794632-4: Micro MATE-N-LOK, Rectangular Power Connectors, Header, Plug, Wire-to-Board, 14 Position
R49 = Resistor

## Nets that join several sheets
3V3-BMS: Battery Mgmt Sys - AMS (14 pins), CAN - STM32F4 (C37.2 C38.2 U14.3 U15.3), Isolated Comms - AMS (6 pins), BSPD - AMS (14 pins), Latching - AMS (R29.2 R32.2 U9.3), Latching - AMS/Latch Circuit (6 pins), Latching - AMS/Latch Circuit (6 pins), Latching - AMS/Latch Circuit (6 pins), Latching - AMS/Latch Circuit (6 pins), PDOC - AMS (9 pins), Independent Power Supply - AMS (C46.2 U18.5), Linear Voltage Regulators/Vbat-3V3 (C42_Linear_Voltage_Regulators_Vbat-3V3#1.2 D6_Vbat-3V34.2 U16_Vbat-3V34.1), Linear Voltage Regulators/Vbat-3V3 (C42_Linear_Voltage_Regulators_Vbat-3V3#2.2 D6_Vbat-3V33.2 U16_Vbat-3V33.1), Linear Voltage Regulators/Vbat-3V3 (C42_Linear_Voltage_Regulators_Vbat-3V3#3.2 D6_Vbat-3V32.2 U16_Vbat-3V32.1), Connectors - AMS (P69.9)
+12: Latching - AMS/Latch Circuit (R52_Latching_-_AMS_Latch_Circuit#1.2), Latching - AMS/Latch Circuit (R52_Latching_-_AMS_Latch_Circuit#2.2), Latching - AMS/Latch Circuit (R52_Latching_-_AMS_Latch_Circuit#3.2), Latching - AMS/Latch Circuit (R52_Latching_-_AMS_Latch_Circuit#4.2), Independent Power Supply - AMS (D3.2), Linear Voltage Regulators/Vbat-3V3 (C41_Linear_Voltage_Regulators_Vbat-3V3#1.2 U16_Vbat-3V34.3), Linear Voltage Regulators/Vbat-3V3 (C41_Linear_Voltage_Regulators_Vbat-3V3#2.2 U16_Vbat-3V33.3), Linear Voltage Regulators/Vbat-3V3 (C41_Linear_Voltage_Regulators_Vbat-3V3#3.2 U16_Vbat-3V32.3), Connectors - AMS (P69.1 P69.3)
+12-BMS: Independent Power Supply - AMS (C45.2 U18.1), Connectors - AMS (J5.3 J5.4)
GND: Battery Mgmt Sys - AMS (31 pins), CAN - STM32F4 (12 pins), Current Sense - AMS (R41.2), Isolated Comms - AMS (10 pins), BSPD - AMS (16 pins), Latching - AMS (Q1.2 R30.1 R31.1 U9.1), Latching - AMS/Latch Circuit (10 pins), Latching - AMS/Latch Circuit (10 pins), Latching - AMS/Latch Circuit (10 pins), Latching - AMS/Latch Circuit (10 pins), PDOC - AMS (12 pins), Independent Power Supply - AMS (5 pins), Linear Voltage Regulators/Vbat-3V3 (5 pins), Linear Voltage Regulators/Vbat-3V3 (5 pins), Linear Voltage Regulators/Vbat-3V3 (5 pins), Connectors - AMS (10 pins)
ADC.~{CS}: Battery Mgmt Sys - AMS (U3.11), Current Sense - AMS (U13.10)
ADC.SCK: Battery Mgmt Sys - AMS (U3.29), Current Sense - AMS (U13.9)
ADC.SDO: Battery Mgmt Sys - AMS (U3.10), Current Sense - AMS (U13.8)
AMS.LED: Latching - AMS/Latch Circuit (R56_Latch_Circuit3.2), Connectors - AMS (P69.8)
BMS-Ready: Battery Mgmt Sys - AMS (TP4.1 U3.40), Latching - AMS (R29.1), Latching - AMS/Latch Circuit (IC1_Latch_Circuit3.3)
BMS.~{CS}: Battery Mgmt Sys - AMS (CS.1 U3.20), Isolated Comms - AMS (U1.5)
BMS.MISO: Battery Mgmt Sys - AMS (MISO.1 U3.22), Isolated Comms - AMS (U1.3)
BMS.MOSI: Battery Mgmt Sys - AMS (MOSI.1 U3.23), Isolated Comms - AMS (U1.2)
BMS.SCK: Battery Mgmt Sys - AMS (SCK.1 U3.21), Isolated Comms - AMS (U1.4)
BSPD-Ready: BSPD - AMS (U5.7), Latching - AMS/Latch Circuit (IC1_Latch_Circuit1.3)
BSPD.LED: Latching - AMS/Latch Circuit (R56_Latch_Circuit1.2), Connectors - AMS (P69.10)
BSPD_N: BSPD - AMS (R23.1 R57.1 U4.4 U7.2), Connectors - AMS (P5.2)
BSPD_P: BSPD - AMS (R22.1 R57.2 U4.3 U7.1), Connectors - AMS (P5.1)
CAN1.Diff_N: CAN - STM32F4 (D4.2 R46.1 U14.6), Connectors - AMS (P5.7)
CAN1.Diff_P: CAN - STM32F4 (D4.1 R45.1 U14.7), Connectors - AMS (P5.8)
CAN1.LBK: Battery Mgmt Sys - AMS (U3.59), CAN - STM32F4 (R43.2 U14.5)
CAN1.RX: Battery Mgmt Sys - AMS (U3.61), CAN - STM32F4 (U14.4)
CAN1.TX: Battery Mgmt Sys - AMS (U3.62), CAN - STM32F4 (U14.1)
CAN2.Diff_N: CAN - STM32F4 (D5.2 R48.1 U15.6), Connectors - AMS (P5.10)
CAN2.Diff_P: CAN - STM32F4 (D5.1 R47.1 U15.7), Connectors - AMS (P5.9)
CAN2.LBK: Battery Mgmt Sys - AMS (U3.35), CAN - STM32F4 (R44.2 U15.5)
CAN2.RX: Battery Mgmt Sys - AMS (U3.33), CAN - STM32F4 (U15.4)
CAN2.TX: Battery Mgmt Sys - AMS (U3.34), CAN - STM32F4 (U15.1)
CHA+: Current Sense - AMS (C33.2 R39.2 U13.2), BSPD - AMS (R24.2)
IMD-In: Latching - AMS (R28.2), Connectors - AMS (P69.5)
IMD.LED: Latching - AMS/Latch Circuit (R56_Latch_Circuit4.2), Connectors - AMS (P69.12)
MCU.AMS: Battery Mgmt Sys - AMS (U3.54), Latching - AMS/Latch Circuit (6 pins)
MCU.BSPD: Battery Mgmt Sys - AMS (U3.51), Latching - AMS/Latch Circuit (6 pins)
MCU.IMD: Battery Mgmt Sys - AMS (U3.53), Latching - AMS/Latch Circuit (6 pins)
MCU.PDOC: Battery Mgmt Sys - AMS (U3.52), Latching - AMS/Latch Circuit (6 pins)
NetIC1_Latch_Circuit4_3: Latching - AMS (R28.1 R30.2), Latching - AMS/Latch Circuit (IC1_Latch_Circuit4.3)
NetK1_Latch_Circuit1_11: Latching - AMS/Latch Circuit (K1_Latch_Circuit3.14), Latching - AMS/Latch Circuit (K1_Latch_Circuit1.11)
NetK1_Latch_Circuit1_14: Latching - AMS/Latch Circuit (K1_Latch_Circuit4.11), Latching - AMS/Latch Circuit (K1_Latch_Circuit1.14)
NetK1_Latch_Circuit2_11: Latching - AMS/Latch Circuit (K1_Latch_Circuit4.14), Latching - AMS/Latch Circuit (K1_Latch_Circuit2.11)
PDOC-In: Latching - AMS (Q1.1 R31.2), PDOC - AMS (PDOC.1 U11.8)
PDOC-Ready: Latching - AMS (Q1.3 R32.1), Latching - AMS/Latch Circuit (IC1_Latch_Circuit2.3)
PDOC.LED: Latching - AMS/Latch Circuit (R56_Latch_Circuit2.2), Connectors - AMS (P69.14)
Reset: Latching - AMS (D2.2), Latching - AMS/Latch Circuit (U17_Latch_Circuit4.2), Latching - AMS/Latch Circuit (U17_Latch_Circuit3.2), Latching - AMS/Latch Circuit (U17_Latch_Circuit2.2), Latching - AMS/Latch Circuit (U17_Latch_Circuit1.2), Connectors - AMS (P69.11 R49.1)
Safe-IN: Latching - AMS/Latch Circuit (K1_Latch_Circuit3.11), Connectors - AMS (P69.2)
Safe-OUT: Latching - AMS/Latch Circuit (K1_Latch_Circuit2.14), Connectors - AMS (P69.13)
SafeIN1: Battery Mgmt Sys - AMS (R11.2), Connectors - AMS (J4.1)
SafeIN2: Battery Mgmt Sys - AMS (R13.2), Connectors - AMS (J4.2)
SafeIN3: Battery Mgmt Sys - AMS (R9.2), Connectors - AMS (J4.3)
SafeIN4: Battery Mgmt Sys - AMS (R7.2), Connectors - AMS (J4.4)